# EAGLE schematic board1 (EAGLE 7.3.0)
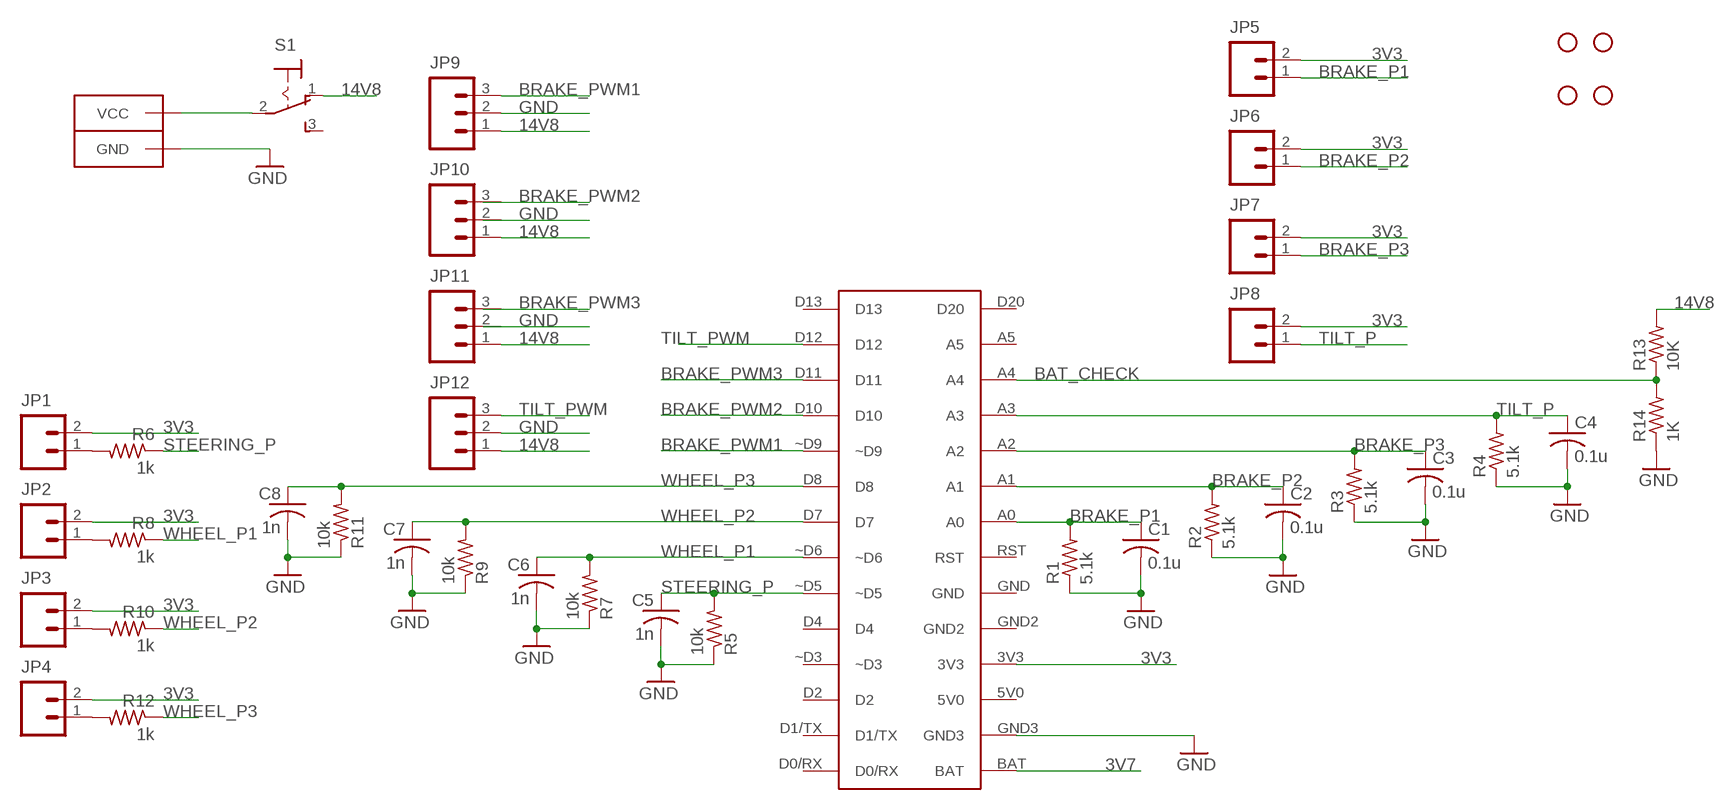
[diagram p0: schematic, sheet 1]

## Parts
C1  0.1u  C-USC0805  [C0805]
C2  0.1u  C-USC0805  [C0805]
C3  0.1u  C-USC0805  [C0805]
C4  0.1u  C-USC0805  [C0805]
C5  1n  C-USC0805  [C0805]
C6  1n  C-USC0805  [C0805]
C7  1n  C-USC0805  [C0805]
C8  1n  C-USC0805  [C0805]
CONN1  ANDERSONHORIZONTAL  [ANDERSON_HORIZONTAL]
JP1  M02PTH  [1X02]
JP2  M02PTH  [1X02]
JP3  M02PTH  [1X02]
JP4  M02PTH  [1X02]
JP5  M02PTH  [1X02]
JP6  M02PTH  [1X02]
JP7  M02PTH  [1X02]
JP8  M02PTH  [1X02]
JP9  M03PTH  [1X03]
JP10  M03PTH  [1X03]
JP11  M03PTH  [1X03]
JP12  M03PTH  [1X03]
JP13  STAND-OFF  [STAND-OFF]
JP14  STAND-OFF  [STAND-OFF]
JP15  STAND-OFF  [STAND-OFF]
JP16  STAND-OFF  [STAND-OFF]
R1  5.1k  R-US_R0805  [R0805]
R2  5.1k  R-US_R0805  [R0805]
R3  5.1k  R-US_R0805  [R0805]
R4  5.1k  R-US_R0805  [R0805]
R5  10k  R-US_R0805  [R0805]
R6  1k  R-US_R0805  [R0805]
R7  10k  R-US_R0805  [R0805]
R8  1k  R-US_R0805  [R0805]
R9  10k  R-US_R0805  [R0805]
R10  1k  R-US_R0805  [R0805]
R11  10k  R-US_R0805  [R0805]
R12  1k  R-US_R0805  [R0805]
R13  10K  R-US_R0805  [R0805]
R14  1K  R-US_R0805  [R0805]
S1  320-916  [320-916]
U$1  CURIENANO_BREAKOUT  [CURIENANO]

## Nets
3V3: JP1.2 JP2.2 JP3.2 JP4.2 JP5.2 JP6.2 JP7.2 JP8.2 U$1.3V3
3V7: U$1.BAT
14V8: JP9.1 JP10.1 JP11.1 JP12.1 R13.2 S1.1(O)
BAT_CHECK: R13.1 R14.2 U$1.A4
BRAKE_P1: C1.1 JP5.1 R1.2 U$1.A0
BRAKE_P2: C2.1 JP6.1 R2.2 U$1.A1
BRAKE_P3: C3.1 JP7.1 R3.2 U$1.A2
BRAKE_PWM1: JP9.3 U$1.~D9
BRAKE_PWM2: JP10.3 U$1.D10
BRAKE_PWM3: JP11.3 U$1.D11
GND: C1.2 C2.2 C3.2 C4.2 C5.2 C6.2 C7.2 C8.2 CONN1.PIN1(GND) CONN1.PIN1-LEAD(GND) JP9.2 JP10.2 JP11.2 JP12.2 R1.1 R2.1 R3.1 R4.1 R5.1 R7.1 R9.1 R11.1 R14.1 U$1.GND3
N$1: JP1.1 R6.2
N$2: JP2.1 R8.2
N$3: JP3.1 R10.2
N$4: JP4.1 R12.2
N$5: CONN1.PIN2(VCC) CONN1.PIN2-LEAD(VCC) S1.2(P)
STEERING_P: C5.1 R5.2 R6.1 U$1.~D5
TILT_P: C4.1 JP8.1 R4.2 U$1.A3
TILT_PWM: JP12.3 U$1.D12
WHEEL_P1: C6.1 R7.2 R8.1 U$1.~D6
WHEEL_P2: C7.1 R9.2 R10.1 U$1.D7
WHEEL_P3: C8.1 R11.2 R12.1 U$1.D8
Unconnected: S1.3(S) U$1.5V0 U$1.A5 U$1.D0/RX U$1.D1/TX U$1.D2 U$1.D4 U$1.D13 U$1.D20 U$1.GND U$1.GND2 U$1.RST U$1.~D3

## Library data of the parts
C1-C8 = adafruit:C-US: CAPACITOR, American symbol
CONN1 = ee192:ANDERSON: 2-pin 25A Anderson Connector http://www.alliedelec.com/images/products/datasheets/bm/ANDERSON_POWER_PRODUCTS/70162018.pdf; PIE-INT-REF-NUM: Anderson
JP1-JP8 = ee192:M02: 2-pin 0.1-inch header and MTA connector Courtsey of Pioneers in Engineering; PIE-INT-REF-NUM: BULK-STOCK
JP9-JP12 = ee192:M03: 3-pin 0.1-inch header and MTA connector Courtsey of Pioneers in Engineering; PIE-INT-REF-NUM: BULK-STOCK
JP13-JP16 = ee192:STAND-OFF: Stand Off This is the mechanical footprint for a #4 phillips button head screw. Use the keepout ring to avoid running the screw head into surrounding components. SKU : PRT-00447
R1-R14 = resistor:R-US_: RESISTOR, American symbol
S1 = switch:320-916: TOGGLE SWITCH distributor RS Components
U$1 = Curie Nano:CURIENANO_BREAKOUT